# Altium schematic sheet POWER.SchDoc: Power
size A4; CompanyName: James Cook University; DrawnBy: CC2511 AS2 Group 1; Organization: James Cook University; Revision: 1.0; SheetNumber: 3; SheetTotal: 4; ProjectName: *ProjectName
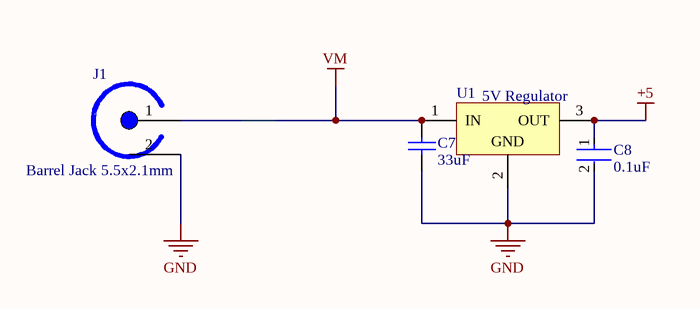
[diagram p0: POWER.SchDoc]

## Parts
C7  33uF  [CAPC0805(2012)100_L]
C8  0.1uF  [FP-0805B-IPC_C]
J1  Barrel Jack 5.5x2.1mm  [Barrel Jack 2.1x5.5mm THT]
U1  5V Regulator  [TO220]

## Nets
+5: C8.1 U1.3(OUT)
GND: C7.1 C8.2 J1.2(SLEEVE) U1.2(GND)
VM: C7.2 J1.1(TIP) U1.1(IN)

## Notes on the sheet
- Date:
- Sheet
- of
- Time:
- Revision:
- Drawn by:
- File:

## Library data of the parts
C7 = CMP-1036-04603-1: CAP 330nF 25V -20% to +80% 0805 (2012 Metric) Thickness 1mm SMD; Case-EIA: 0805; Case-Metric: 2012; Value: 330nF; Rated Voltage: 25 V; Technology: SMT; Max Thickness: 1 mm; Tolerance: -20% to +80%
C8 = CMP-45632-000003-1: CAP CER 0.1UF 50V X7R 0805; Capacitance: 100nF; Tolerance: 10%; RoHS Compliant: Yes; Packaging: Tape and Reel; Voltage Rating (DC): 50V; Voltage Rating: 50V; Length: 2mm; Lead Free: Lead Free; Voltage: 50V; Case/Package: 0805; Case Code (Metric): 2012; Depth: 1.25mm; Min Operating Temperature: -55°C; Case Code (Imperial): 0805; Max Operating Temperature: 125°C; Radiation Hardening: No; Dielectric: X7R
J1 = CMP-005-0005-1: GCT DCJ200-10-A-K1-K; Pins: 2; Component Type: Standard; Design Item ID: Barrel Jack 5.5x2.1mm; Source: JCULibrary.SchLib
U1 = CMP-0244-00483-1: Positive Voltage Regulator, 5V, 3-Pin TO-220; PackageDescription: TO, Thru-Hole, Vertical, Heatsink Mounted; 3 In-Line Leads; Pitch 2.54 mm; ComponentLink2Description: Datasheet; PackageReference: TO220; ComponentLink3URL: http://www.st.com/internet/com/TECHNICAL_RESOURCES/TECHNICAL_LITERATURE/PACKAGE_INFORMATION/CD00004649.pdf; DatasheetVersion: 16/11/2011; ComponentLink1Description: Manufacturer URL; ComponentLink1URL: http://www.st.com; PackageVersion: ver3.0; ComponentLink3Description: Package Specification; ComponentLink2URL: http://www.st.com/internet/com/TECHNICAL_RESOURCES/TECHNICAL_LITERATURE/DATASHEET/CD00000444.pdf